# EAGLE schematic Tricorder-BoosterPack (EAGLE 7.4.0)
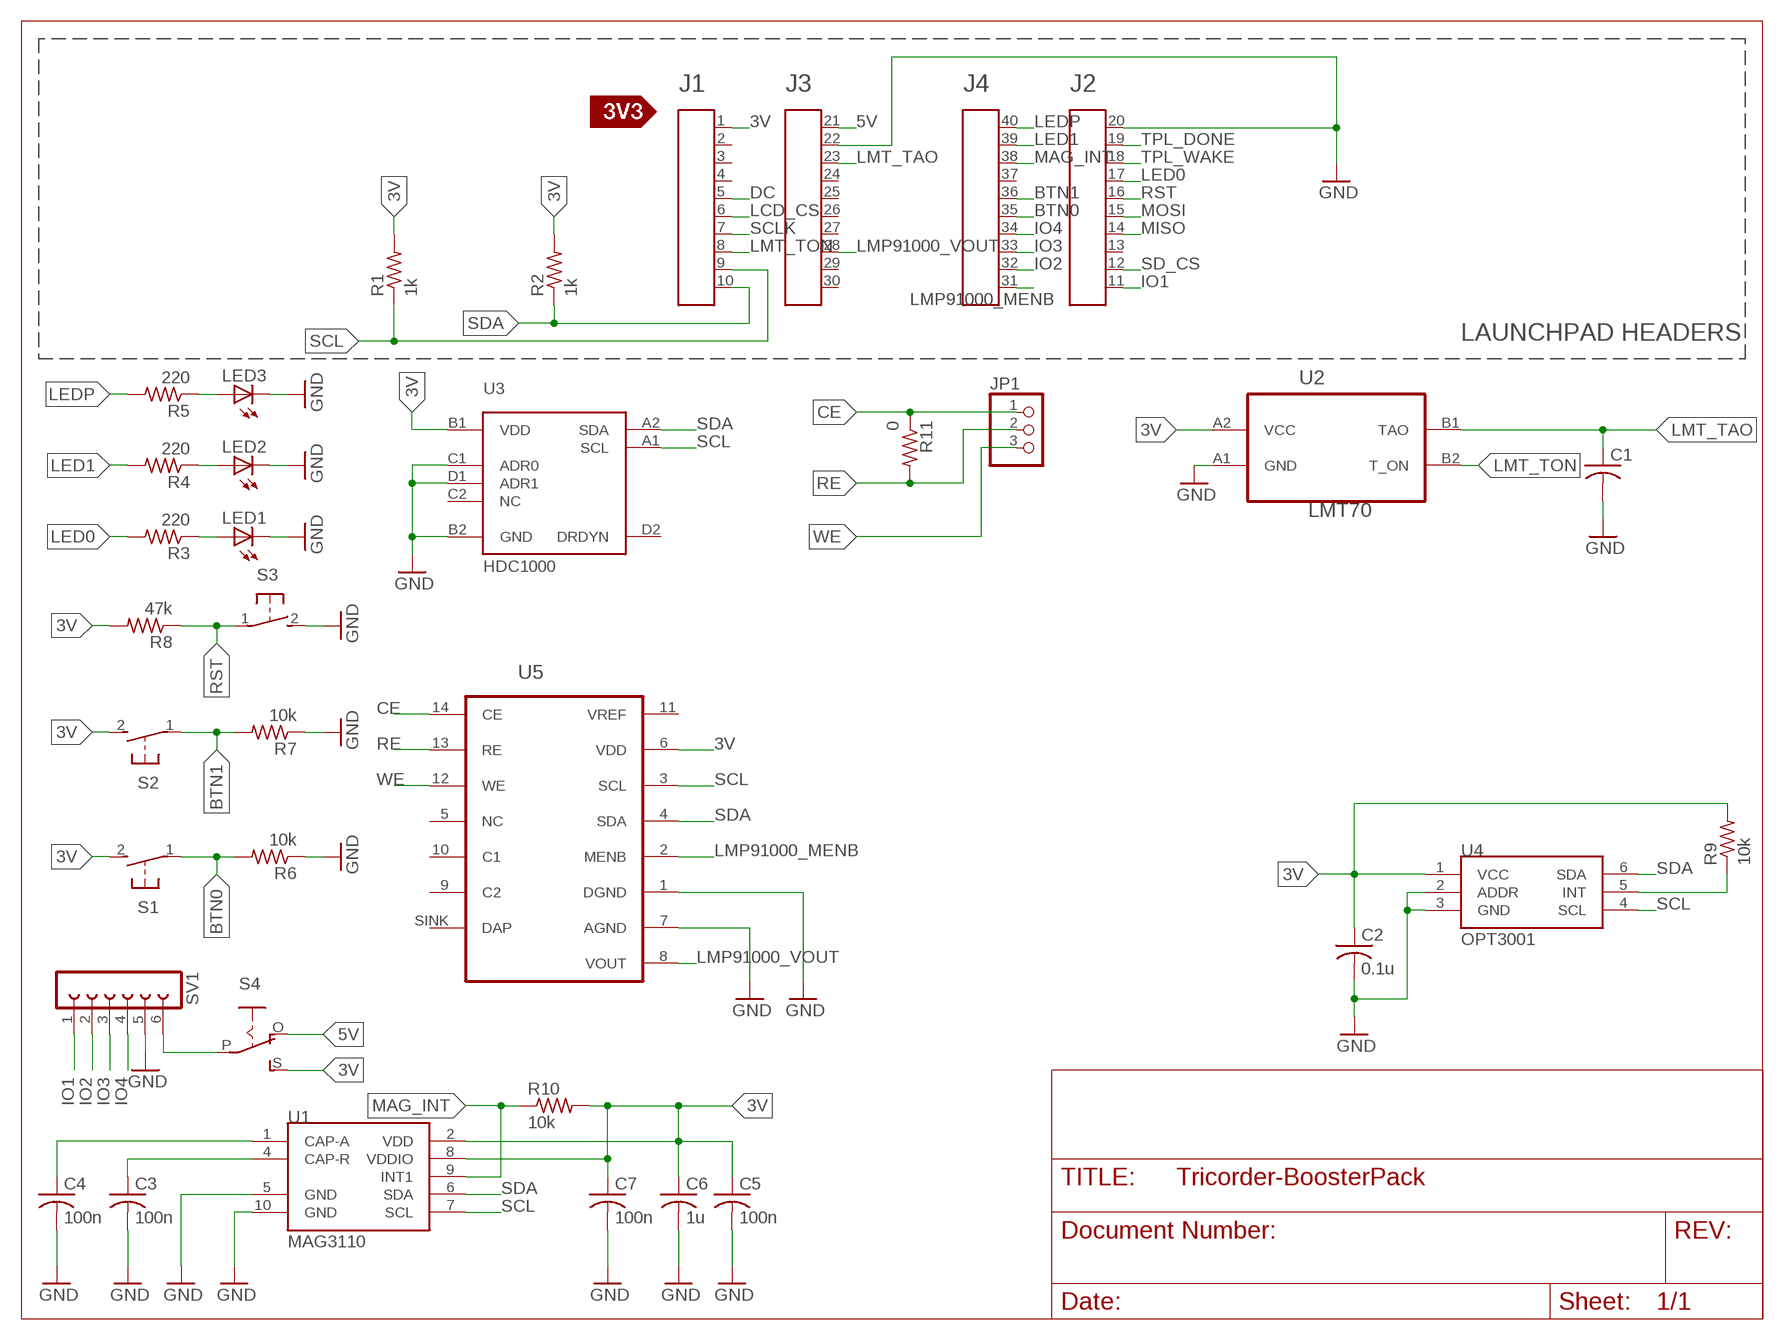
[diagram p0: schematic, sheet 1]

## Parts
A1  HEADER4X10-BOOSTERPACK  [4X10-BOOSTERPACK]
C1  C-USC0603  [C0603]
C2  0.1u  C-USC0603  [C0603]
C3  100n  C-USC0603  [C0603]
C4  100n  C-USC0603  [C0603]
C5  100n  C-USC0603  [C0603]
C6  1u  C-USC0603  [C0603]
C7  100n  C-USC0603  [C0603]
JP1  PINHD-1X3CB  [1X03-CLEANBIG]
LED1  LEDCHIPLED_0603  [CHIPLED_0603]
LED2  LEDCHIPLED_0603  [CHIPLED_0603]
LED3  LEDCHIPLED_0603  [CHIPLED_0603]
R1  1k  R-US_R0603  [R0603]
R2  1k  R-US_R0603  [R0603]
R3  220  R-US_R0603  [R0603]
R4  220  R-US_R0603  [R0603]
R5  220  R-US_R0603  [R0603]
R6  10k  R-US_R0603  [R0603]
R7  10k  R-US_R0603  [R0603]
R8  47k  R-US_R0603  [R0603]
R9  10k  R-US_R0603  [R0603]
R10  10k  R-US_R0603  [R0603]
R11  0  R-US_R0603  [R0603]
S1  31-XX  [B3F-31XX]
S2  31-XX  [B3F-31XX]
S3  31-XX  [B3F-31XX]
S4  EG1218S  [EG1218]
SV1  FE06-1  [FE06]
U1  MAG3110  [DFN-10]
U2  LMT70LMT70  [BGA4C40P2X2_77X77X50]
U3  HDC1000  [DSBGA_8_YPA]
U4  OPT3001  [SOT23-6]
U5  LMP91000  [WFDFN-14]
U$3  SILK_3V3_TAG  [SILK_3V3_TAG]

## Nets
3V: A1.1 C2.1 R1.2 R2.2 R8.2 R9.2 S1.2(S) S2.2(S) S4.S U3.B1(VDD) U4.1(VCC) U5.6(VDD)
5V: A1.21 S4.O
BTN0: A1.35 R6.2 S1.1(P)
BTN1: A1.36 R7.2 S2.1(P)
CE: JP1.1 R11.1 U5.14(CE)
DC: A1.5
GND: A1.20 A1.22 C1.2 C2.2 C3.2 C4.2 C5.2 C6.2 C7.2 LED1.C LED2.C LED3.C R6.1 R7.1 S3.2(S) SV1.5 U1.5(GND) U1.10(GND) U2.A1(GND) U3.B2(GND) U3.C1(ADR0) U3.D1(ADR1) U4.2(ADDR) U4.3(GND) U5.1(DGND) U5.7(AGND)
IO1: A1.11 SV1.1
IO2: A1.32 SV1.2
IO3: A1.33 SV1.3
IO4: A1.34 SV1.4
LCD_CS: A1.6
LED0: A1.17 R3.2
LED1: A1.39 R4.2
LEDP: A1.40 R5.2
LMP91000_MENB: A1.31 U5.2(MENB)
LMP91000_VOUT: A1.28 U5.8(VOUT)
LMT_TAO: A1.23 C1.1 U2.B1(TAO)
LMT_TON: A1.8 U2.B2(T_ON)
MAG_INT: A1.38 R10.1 U1.9(INT1)
MISO: A1.14
MOSI: A1.15
N$1: LED1.A R3.1
N$2: LED2.A R4.1
N$3: LED3.A R5.1
N$4: S4.P SV1.6
N$5: R9.1 U4.5(INT)
N$6: U2.A2(VCC)
N$8: C3.1 U1.4(CAP-R)
N$9: C4.1 U1.1(CAP-A)
N$11: C5.1 C6.1 C7.1 R10.2 U1.2(VDD) U1.8(VDDIO)
RE: JP1.2 R11.2 U5.13(RE)
RST: A1.16 R8.1 S3.1(P)
SCL: A1.9 R1.1 U1.7(SCL) U3.A1(SCL) U4.4(SCL) U5.3(SCL)
SCLK: A1.7
SD_CS: A1.12
SDA: A1.10 R2.1 U1.6(SDA) U3.A2(SDA) U4.6(SDA) U5.4(SDA)
TPL_DONE: A1.19
TPL_WAKE: A1.18
WE: JP1.3 U5.12(WE)
Unconnected: A1.2 A1.3 A1.4 A1.13 A1.24 A1.25 A1.26 A1.27 A1.29 A1.30 A1.37 U3.C2(NC) U3.D2(DRDYN) U5.5(NC) U5.9(C2) U5.10(C1) U5.SINK(DAP)

## Notes on the sheet
- LAUNCHPAD HEADERS

## Power pins joined to a net without a drawn wire
VREF: U5.11(VREF)

## Library data of the parts
A1 = Public_BP_Library:HEADER4X10-BOOSTERPACK
C1-C7 = adafruit:C-US: CAPACITOR, American symbol
JP1 = adafruit:PINHD-1X3: PIN HEADER
LED1-LED3 = adafruit:LED: LED OSRAM: - CHIPLED LG R971, LG N971, LY N971, LG Q971, LY Q971, LO R971, LY R971 LH N974, LH R974 LS Q976, LO Q976, LY Q976 LO Q996 - Hyper CHIPLED LW Q18S LB Q993, LB Q99A, LB R99A - SideLED LS A670, LO A670, LY A670, LG A670, LP A670 LB A673, LV A673, LT A673, LW A673 LH A674 LY A675 LS A676, LA A676, LO A676, LY A676, LW A676 LS A679, LY A679, LG A679 - Hyper Micro SIDELED® LS Y876, LA Y876, LO Y876, LY Y876 LT Y87S - SmartLED LW L88C, LW L88S LB L89C, LB L89S, LG L890 LS L89K, LO L89K, LY L89K LS L896, LA L896, LO L896, LY L896 - TOPLED LS T670, LO T670, LY T670, LG T670, LP T670 LSG T670, LSP T670, LSY T670, LOP T670, LYG T670 LG T671, LOG T671, LSG T671 LB T673, LV T673, LT T673, LW T673 LH T674 LS T676, LA T676, LO T676, LY T676, LB T676, LH T676, LSB T676, LW T676 LB T67C, LV T67C, LT T67C, LS T67K, LO T67K, LY T67K, LW E67C LS E67B, LA E67B, LO E67B, LY E67B, LB E67C, LV E67C, LT E67C LW T67C LS T679, LY T679, LG T679 LS T770, LO T770, LY T770, LG T770, LP T770 LB T773, LV T773, LT T773, LW T773 LH T774 LS E675, LA E675, LY E675, LS T675 LS T776, LA T776, LO T776, LY T776, LB T776 LHGB T686 LT T68C, LB T68C - Hyper Mini TOPLED® LB M676 - Mini TOPLED Santana® LG M470 LS M47K, LO M47K, LY M47K Source: http://www.osram.convergy.de/
R1-R11 = resistor:R-US_: RESISTOR, American symbol
S1-S3 = adafruit:31-XX: OMRON SWITCH Now with beefier pads!
S4 = adafruit:EG1218: SLIDING SWITCH 0.1" spacing through hole, vertical SPDT slide switch http://www.ladyada.net/library/pcb/eaglelibrary.html
SV1 = con-lsta:FE06-1: FEMALE HEADER; OC_FARNELL: unknown; OC_NEWARK: unknown
U1 = SparkFun-Sensors:MAG3110: 3-axis digital (I2C) magnetometer
U2 = LMT70:LMT70: LOW-POWER SINGLE INVERTER GATE; MPN: LMT70; OC_FARNELL: -; OC_NEWARK: 50R7866; PACKAGE: BGA-4; SUPPLIER: Texas Instruments
U3 = Fra:HDC1000
U4 = OPT3001:OPT3001
U5 = LMP91000:LMP91000: IC TI AFE for Gas Sensing; DIGIKEY: LMP91000SDE/NOPBCT-ND
U$3 = Public_BP_Library:SILK_3V3_TAG

## Net classes
0 default: width 0.254 mm, drill 0.508 mm